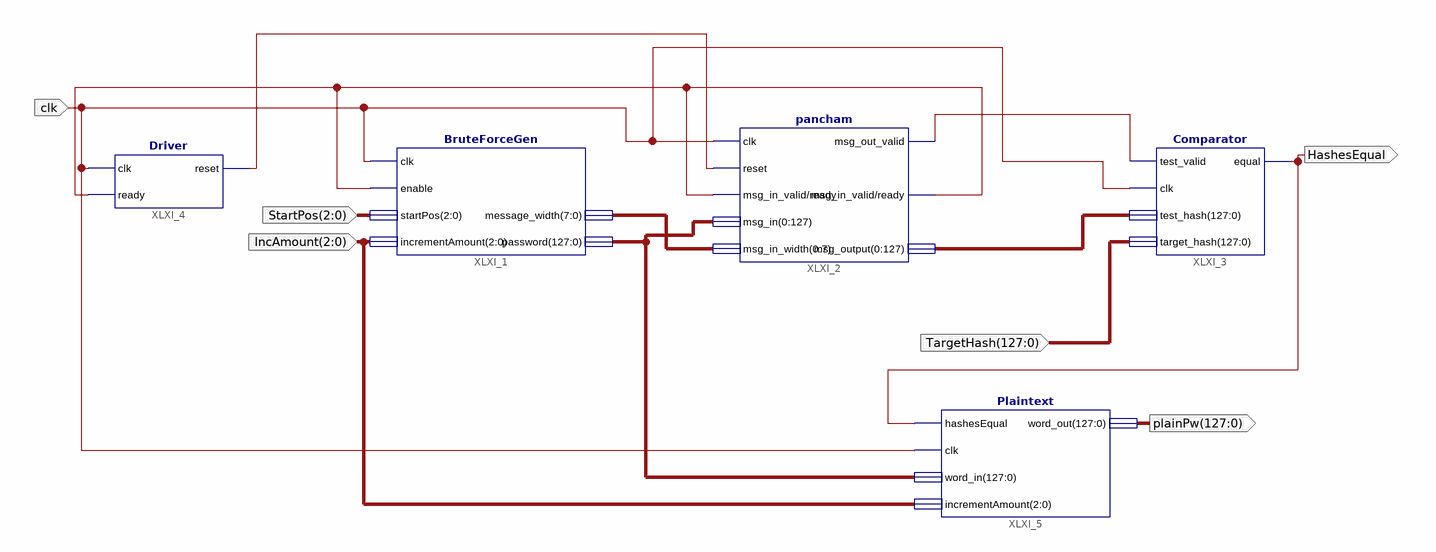
[diagram p0: schematic sheet 1]
// Xilinx ISE schematic MD5_Cracker.sch (spartan6) as structural Verilog: 5 symbols, 6 ports
module MD5_Cracker (
  input  [2:0] IncAmount,
  input  [2:0] StartPos,
  input  clk,
  input  [127:0] TargetHash,
  output HashesEqual,
  output [127:0] plainPw
);

  wire MsgOutValid, Ready, Reset;
  wire [7:0] XLXN_1;
  wire [127:0] GuessHash, GuessPW;

  BruteForceGen XLXI_1 (
    .clk(clk), .enable(Ready), .startPos(StartPos), .incrementAmount(IncAmount), .message_width(XLXN_1),
    .password({GuessPW[0], GuessPW[1], GuessPW[2], GuessPW[3], GuessPW[4], GuessPW[5], GuessPW[6], GuessPW[7], GuessPW[8], GuessPW[9], GuessPW[10], GuessPW[11], GuessPW[12], GuessPW[13], GuessPW[14], GuessPW[15], GuessPW[16], GuessPW[17], GuessPW[18], GuessPW[19], GuessPW[20], GuessPW[21], GuessPW[22], GuessPW[23], GuessPW[24], GuessPW[25], GuessPW[26], GuessPW[27], GuessPW[28], GuessPW[29], GuessPW[30], GuessPW[31], GuessPW[32], GuessPW[33], GuessPW[34], GuessPW[35], GuessPW[36], GuessPW[37], GuessPW[38], GuessPW[39], GuessPW[40], GuessPW[41], GuessPW[42], GuessPW[43], GuessPW[44], GuessPW[45], GuessPW[46], GuessPW[47], GuessPW[48], GuessPW[49], GuessPW[50], GuessPW[51], GuessPW[52], GuessPW[53], GuessPW[54], GuessPW[55], GuessPW[56], GuessPW[57], GuessPW[58], GuessPW[59], GuessPW[60], GuessPW[61], GuessPW[62], GuessPW[63], GuessPW[64], GuessPW[65], GuessPW[66], GuessPW[67], GuessPW[68], GuessPW[69], GuessPW[70], GuessPW[71], GuessPW[72], GuessPW[73], GuessPW[74], GuessPW[75], GuessPW[76], GuessPW[77], GuessPW[78], GuessPW[79], GuessPW[80], GuessPW[81], GuessPW[82], GuessPW[83], GuessPW[84], GuessPW[85], GuessPW[86], GuessPW[87], GuessPW[88], GuessPW[89], GuessPW[90], GuessPW[91], GuessPW[92], GuessPW[93], GuessPW[94], GuessPW[95], GuessPW[96], GuessPW[97], GuessPW[98], GuessPW[99], GuessPW[100], GuessPW[101], GuessPW[102], GuessPW[103], GuessPW[104], GuessPW[105], GuessPW[106], GuessPW[107], GuessPW[108], GuessPW[109], GuessPW[110], GuessPW[111], GuessPW[112], GuessPW[113], GuessPW[114], GuessPW[115], GuessPW[116], GuessPW[117], GuessPW[118], GuessPW[119], GuessPW[120], GuessPW[121], GuessPW[122], GuessPW[123], GuessPW[124], GuessPW[125], GuessPW[126], GuessPW[127]}));
  pancham XLXI_2 (
    .clk(clk), .reset(Reset), .msg_in_valid(Ready),
    .msg_in({GuessPW[0], GuessPW[1], GuessPW[2], GuessPW[3], GuessPW[4], GuessPW[5], GuessPW[6], GuessPW[7], GuessPW[8], GuessPW[9], GuessPW[10], GuessPW[11], GuessPW[12], GuessPW[13], GuessPW[14], GuessPW[15], GuessPW[16], GuessPW[17], GuessPW[18], GuessPW[19], GuessPW[20], GuessPW[21], GuessPW[22], GuessPW[23], GuessPW[24], GuessPW[25], GuessPW[26], GuessPW[27], GuessPW[28], GuessPW[29], GuessPW[30], GuessPW[31], GuessPW[32], GuessPW[33], GuessPW[34], GuessPW[35], GuessPW[36], GuessPW[37], GuessPW[38], GuessPW[39], GuessPW[40], GuessPW[41], GuessPW[42], GuessPW[43], GuessPW[44], GuessPW[45], GuessPW[46], GuessPW[47], GuessPW[48], GuessPW[49], GuessPW[50], GuessPW[51], GuessPW[52], GuessPW[53], GuessPW[54], GuessPW[55], GuessPW[56], GuessPW[57], GuessPW[58], GuessPW[59], GuessPW[60], GuessPW[61], GuessPW[62], GuessPW[63], GuessPW[64], GuessPW[65], GuessPW[66], GuessPW[67], GuessPW[68], GuessPW[69], GuessPW[70], GuessPW[71], GuessPW[72], GuessPW[73], GuessPW[74], GuessPW[75], GuessPW[76], GuessPW[77], GuessPW[78], GuessPW[79], GuessPW[80], GuessPW[81], GuessPW[82], GuessPW[83], GuessPW[84], GuessPW[85], GuessPW[86], GuessPW[87], GuessPW[88], GuessPW[89], GuessPW[90], GuessPW[91], GuessPW[92], GuessPW[93], GuessPW[94], GuessPW[95], GuessPW[96], GuessPW[97], GuessPW[98], GuessPW[99], GuessPW[100], GuessPW[101], GuessPW[102], GuessPW[103], GuessPW[104], GuessPW[105], GuessPW[106], GuessPW[107], GuessPW[108], GuessPW[109], GuessPW[110], GuessPW[111], GuessPW[112], GuessPW[113], GuessPW[114], GuessPW[115], GuessPW[116], GuessPW[117], GuessPW[118], GuessPW[119], GuessPW[120], GuessPW[121], GuessPW[122], GuessPW[123], GuessPW[124], GuessPW[125], GuessPW[126], GuessPW[127]}),
    .msg_in_width(XLXN_1), .msg_out_valid(MsgOutValid), .ready(Ready),
    .msg_output({GuessHash[0], GuessHash[1], GuessHash[2], GuessHash[3], GuessHash[4], GuessHash[5], GuessHash[6], GuessHash[7], GuessHash[8], GuessHash[9], GuessHash[10], GuessHash[11], GuessHash[12], GuessHash[13], GuessHash[14], GuessHash[15], GuessHash[16], GuessHash[17], GuessHash[18], GuessHash[19], GuessHash[20], GuessHash[21], GuessHash[22], GuessHash[23], GuessHash[24], GuessHash[25], GuessHash[26], GuessHash[27], GuessHash[28], GuessHash[29], GuessHash[30], GuessHash[31], GuessHash[32], GuessHash[33], GuessHash[34], GuessHash[35], GuessHash[36], GuessHash[37], GuessHash[38], GuessHash[39], GuessHash[40], GuessHash[41], GuessHash[42], GuessHash[43], GuessHash[44], GuessHash[45], GuessHash[46], GuessHash[47], GuessHash[48], GuessHash[49], GuessHash[50], GuessHash[51], GuessHash[52], GuessHash[53], GuessHash[54], GuessHash[55], GuessHash[56], GuessHash[57], GuessHash[58], GuessHash[59], GuessHash[60], GuessHash[61], GuessHash[62], GuessHash[63], GuessHash[64], GuessHash[65], GuessHash[66], GuessHash[67], GuessHash[68], GuessHash[69], GuessHash[70], GuessHash[71], GuessHash[72], GuessHash[73], GuessHash[74], GuessHash[75], GuessHash[76], GuessHash[77], GuessHash[78], GuessHash[79], GuessHash[80], GuessHash[81], GuessHash[82], GuessHash[83], GuessHash[84], GuessHash[85], GuessHash[86], GuessHash[87], GuessHash[88], GuessHash[89], GuessHash[90], GuessHash[91], GuessHash[92], GuessHash[93], GuessHash[94], GuessHash[95], GuessHash[96], GuessHash[97], GuessHash[98], GuessHash[99], GuessHash[100], GuessHash[101], GuessHash[102], GuessHash[103], GuessHash[104], GuessHash[105], GuessHash[106], GuessHash[107], GuessHash[108], GuessHash[109], GuessHash[110], GuessHash[111], GuessHash[112], GuessHash[113], GuessHash[114], GuessHash[115], GuessHash[116], GuessHash[117], GuessHash[118], GuessHash[119], GuessHash[120], GuessHash[121], GuessHash[122], GuessHash[123], GuessHash[124], GuessHash[125], GuessHash[126], GuessHash[127]}));
  Comparator XLXI_3 (
    .test_valid(MsgOutValid), .clk(clk),
    .test_hash({GuessHash[0], GuessHash[1], GuessHash[2], GuessHash[3], GuessHash[4], GuessHash[5], GuessHash[6], GuessHash[7], GuessHash[8], GuessHash[9], GuessHash[10], GuessHash[11], GuessHash[12], GuessHash[13], GuessHash[14], GuessHash[15], GuessHash[16], GuessHash[17], GuessHash[18], GuessHash[19], GuessHash[20], GuessHash[21], GuessHash[22], GuessHash[23], GuessHash[24], GuessHash[25], GuessHash[26], GuessHash[27], GuessHash[28], GuessHash[29], GuessHash[30], GuessHash[31], GuessHash[32], GuessHash[33], GuessHash[34], GuessHash[35], GuessHash[36], GuessHash[37], GuessHash[38], GuessHash[39], GuessHash[40], GuessHash[41], GuessHash[42], GuessHash[43], GuessHash[44], GuessHash[45], GuessHash[46], GuessHash[47], GuessHash[48], GuessHash[49], GuessHash[50], GuessHash[51], GuessHash[52], GuessHash[53], GuessHash[54], GuessHash[55], GuessHash[56], GuessHash[57], GuessHash[58], GuessHash[59], GuessHash[60], GuessHash[61], GuessHash[62], GuessHash[63], GuessHash[64], GuessHash[65], GuessHash[66], GuessHash[67], GuessHash[68], GuessHash[69], GuessHash[70], GuessHash[71], GuessHash[72], GuessHash[73], GuessHash[74], GuessHash[75], GuessHash[76], GuessHash[77], GuessHash[78], GuessHash[79], GuessHash[80], GuessHash[81], GuessHash[82], GuessHash[83], GuessHash[84], GuessHash[85], GuessHash[86], GuessHash[87], GuessHash[88], GuessHash[89], GuessHash[90], GuessHash[91], GuessHash[92], GuessHash[93], GuessHash[94], GuessHash[95], GuessHash[96], GuessHash[97], GuessHash[98], GuessHash[99], GuessHash[100], GuessHash[101], GuessHash[102], GuessHash[103], GuessHash[104], GuessHash[105], GuessHash[106], GuessHash[107], GuessHash[108], GuessHash[109], GuessHash[110], GuessHash[111], GuessHash[112], GuessHash[113], GuessHash[114], GuessHash[115], GuessHash[116], GuessHash[117], GuessHash[118], GuessHash[119], GuessHash[120], GuessHash[121], GuessHash[122], GuessHash[123], GuessHash[124], GuessHash[125], GuessHash[126], GuessHash[127]}),
    .target_hash(TargetHash), .equal(HashesEqual));
  Driver XLXI_4 (.clk(clk), .ready(Ready), .reset(Reset));
  Plaintext XLXI_5 (
    .hashesEqual(HashesEqual), .clk(clk),
    .word_in({GuessPW[0], GuessPW[1], GuessPW[2], GuessPW[3], GuessPW[4], GuessPW[5], GuessPW[6], GuessPW[7], GuessPW[8], GuessPW[9], GuessPW[10], GuessPW[11], GuessPW[12], GuessPW[13], GuessPW[14], GuessPW[15], GuessPW[16], GuessPW[17], GuessPW[18], GuessPW[19], GuessPW[20], GuessPW[21], GuessPW[22], GuessPW[23], GuessPW[24], GuessPW[25], GuessPW[26], GuessPW[27], GuessPW[28], GuessPW[29], GuessPW[30], GuessPW[31], GuessPW[32], GuessPW[33], GuessPW[34], GuessPW[35], GuessPW[36], GuessPW[37], GuessPW[38], GuessPW[39], GuessPW[40], GuessPW[41], GuessPW[42], GuessPW[43], GuessPW[44], GuessPW[45], GuessPW[46], GuessPW[47], GuessPW[48], GuessPW[49], GuessPW[50], GuessPW[51], GuessPW[52], GuessPW[53], GuessPW[54], GuessPW[55], GuessPW[56], GuessPW[57], GuessPW[58], GuessPW[59], GuessPW[60], GuessPW[61], GuessPW[62], GuessPW[63], GuessPW[64], GuessPW[65], GuessPW[66], GuessPW[67], GuessPW[68], GuessPW[69], GuessPW[70], GuessPW[71], GuessPW[72], GuessPW[73], GuessPW[74], GuessPW[75], GuessPW[76], GuessPW[77], GuessPW[78], GuessPW[79], GuessPW[80], GuessPW[81], GuessPW[82], GuessPW[83], GuessPW[84], GuessPW[85], GuessPW[86], GuessPW[87], GuessPW[88], GuessPW[89], GuessPW[90], GuessPW[91], GuessPW[92], GuessPW[93], GuessPW[94], GuessPW[95], GuessPW[96], GuessPW[97], GuessPW[98], GuessPW[99], GuessPW[100], GuessPW[101], GuessPW[102], GuessPW[103], GuessPW[104], GuessPW[105], GuessPW[106], GuessPW[107], GuessPW[108], GuessPW[109], GuessPW[110], GuessPW[111], GuessPW[112], GuessPW[113], GuessPW[114], GuessPW[115], GuessPW[116], GuessPW[117], GuessPW[118], GuessPW[119], GuessPW[120], GuessPW[121], GuessPW[122], GuessPW[123], GuessPW[124], GuessPW[125], GuessPW[126], GuessPW[127]}),
    .incrementAmount(IncAmount), .word_out(plainPw));
endmodule
